# EAGLE design MSSRP-Temperature_System_beta_lite_2layer (EAGLE 6.5.0)
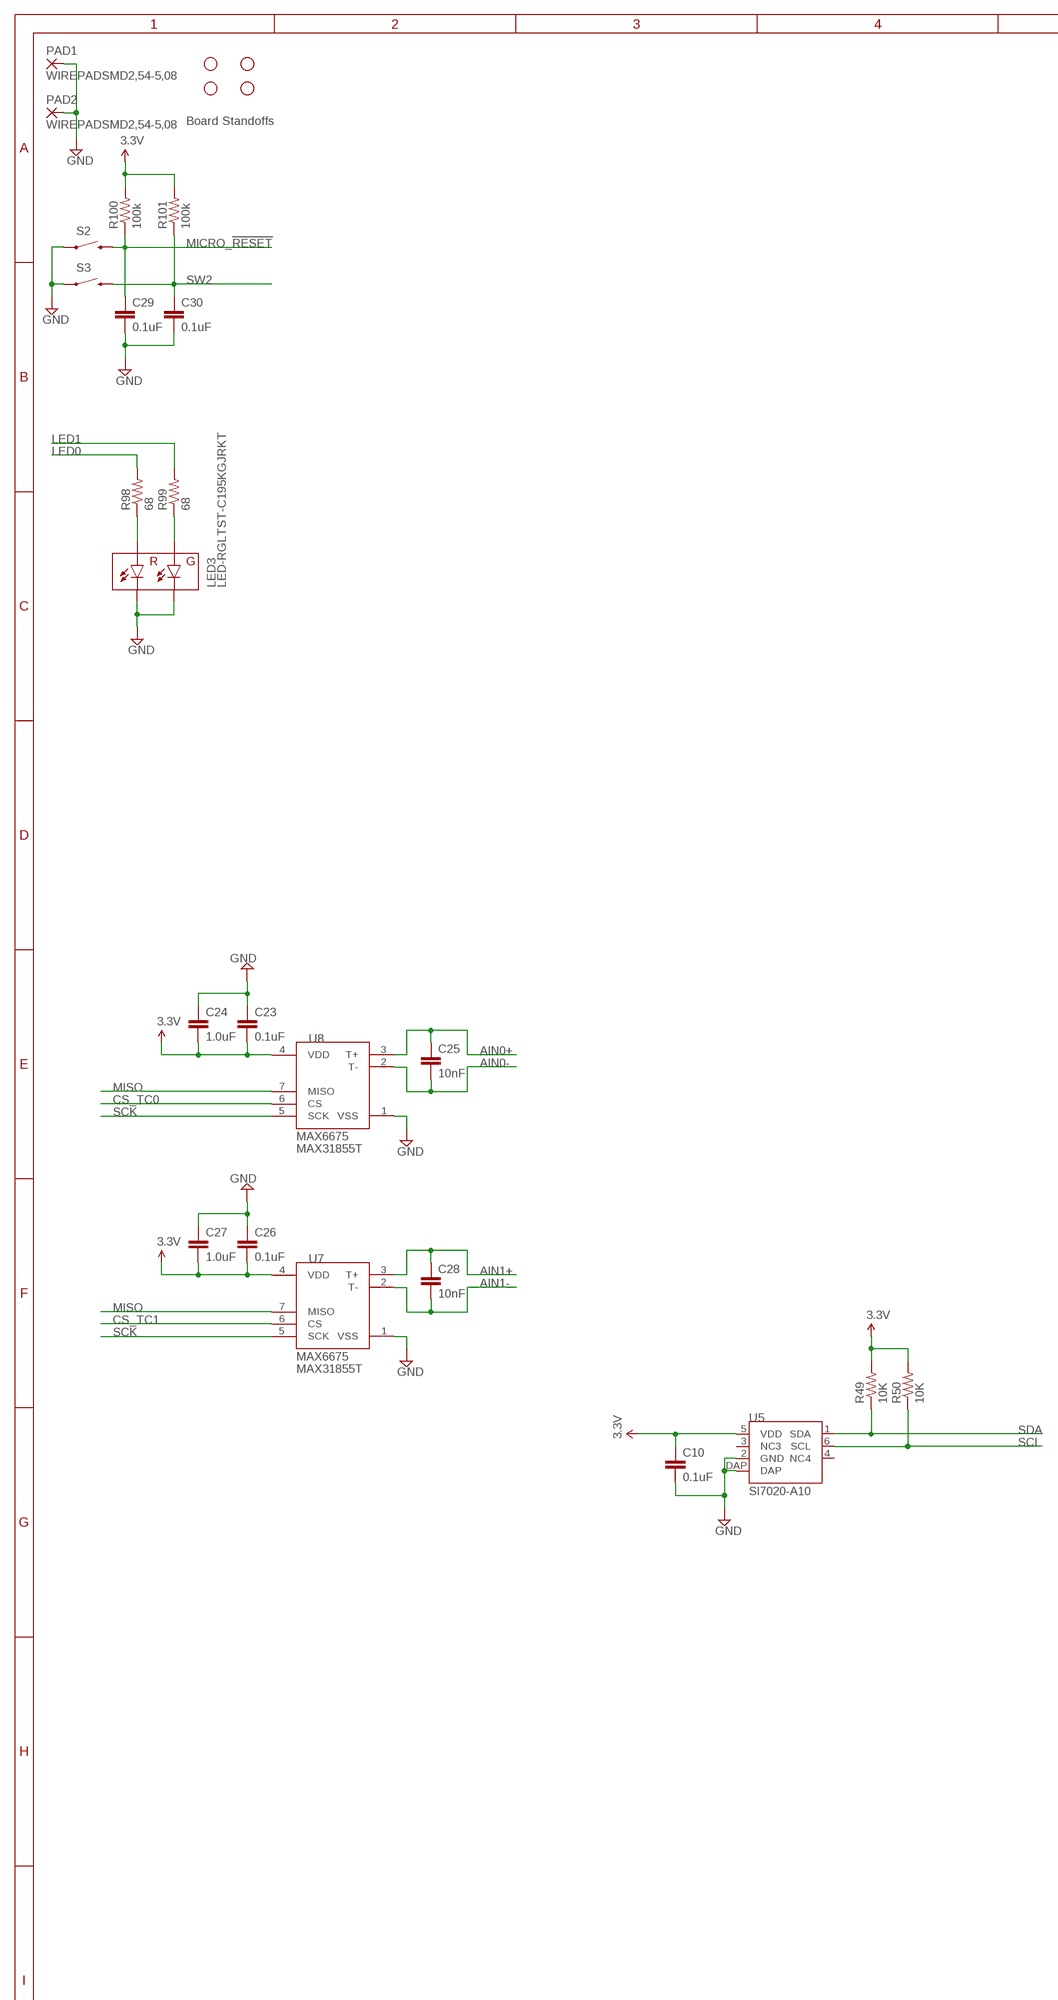
[diagram p0: schematic, sheet 1, part 1 of 2]
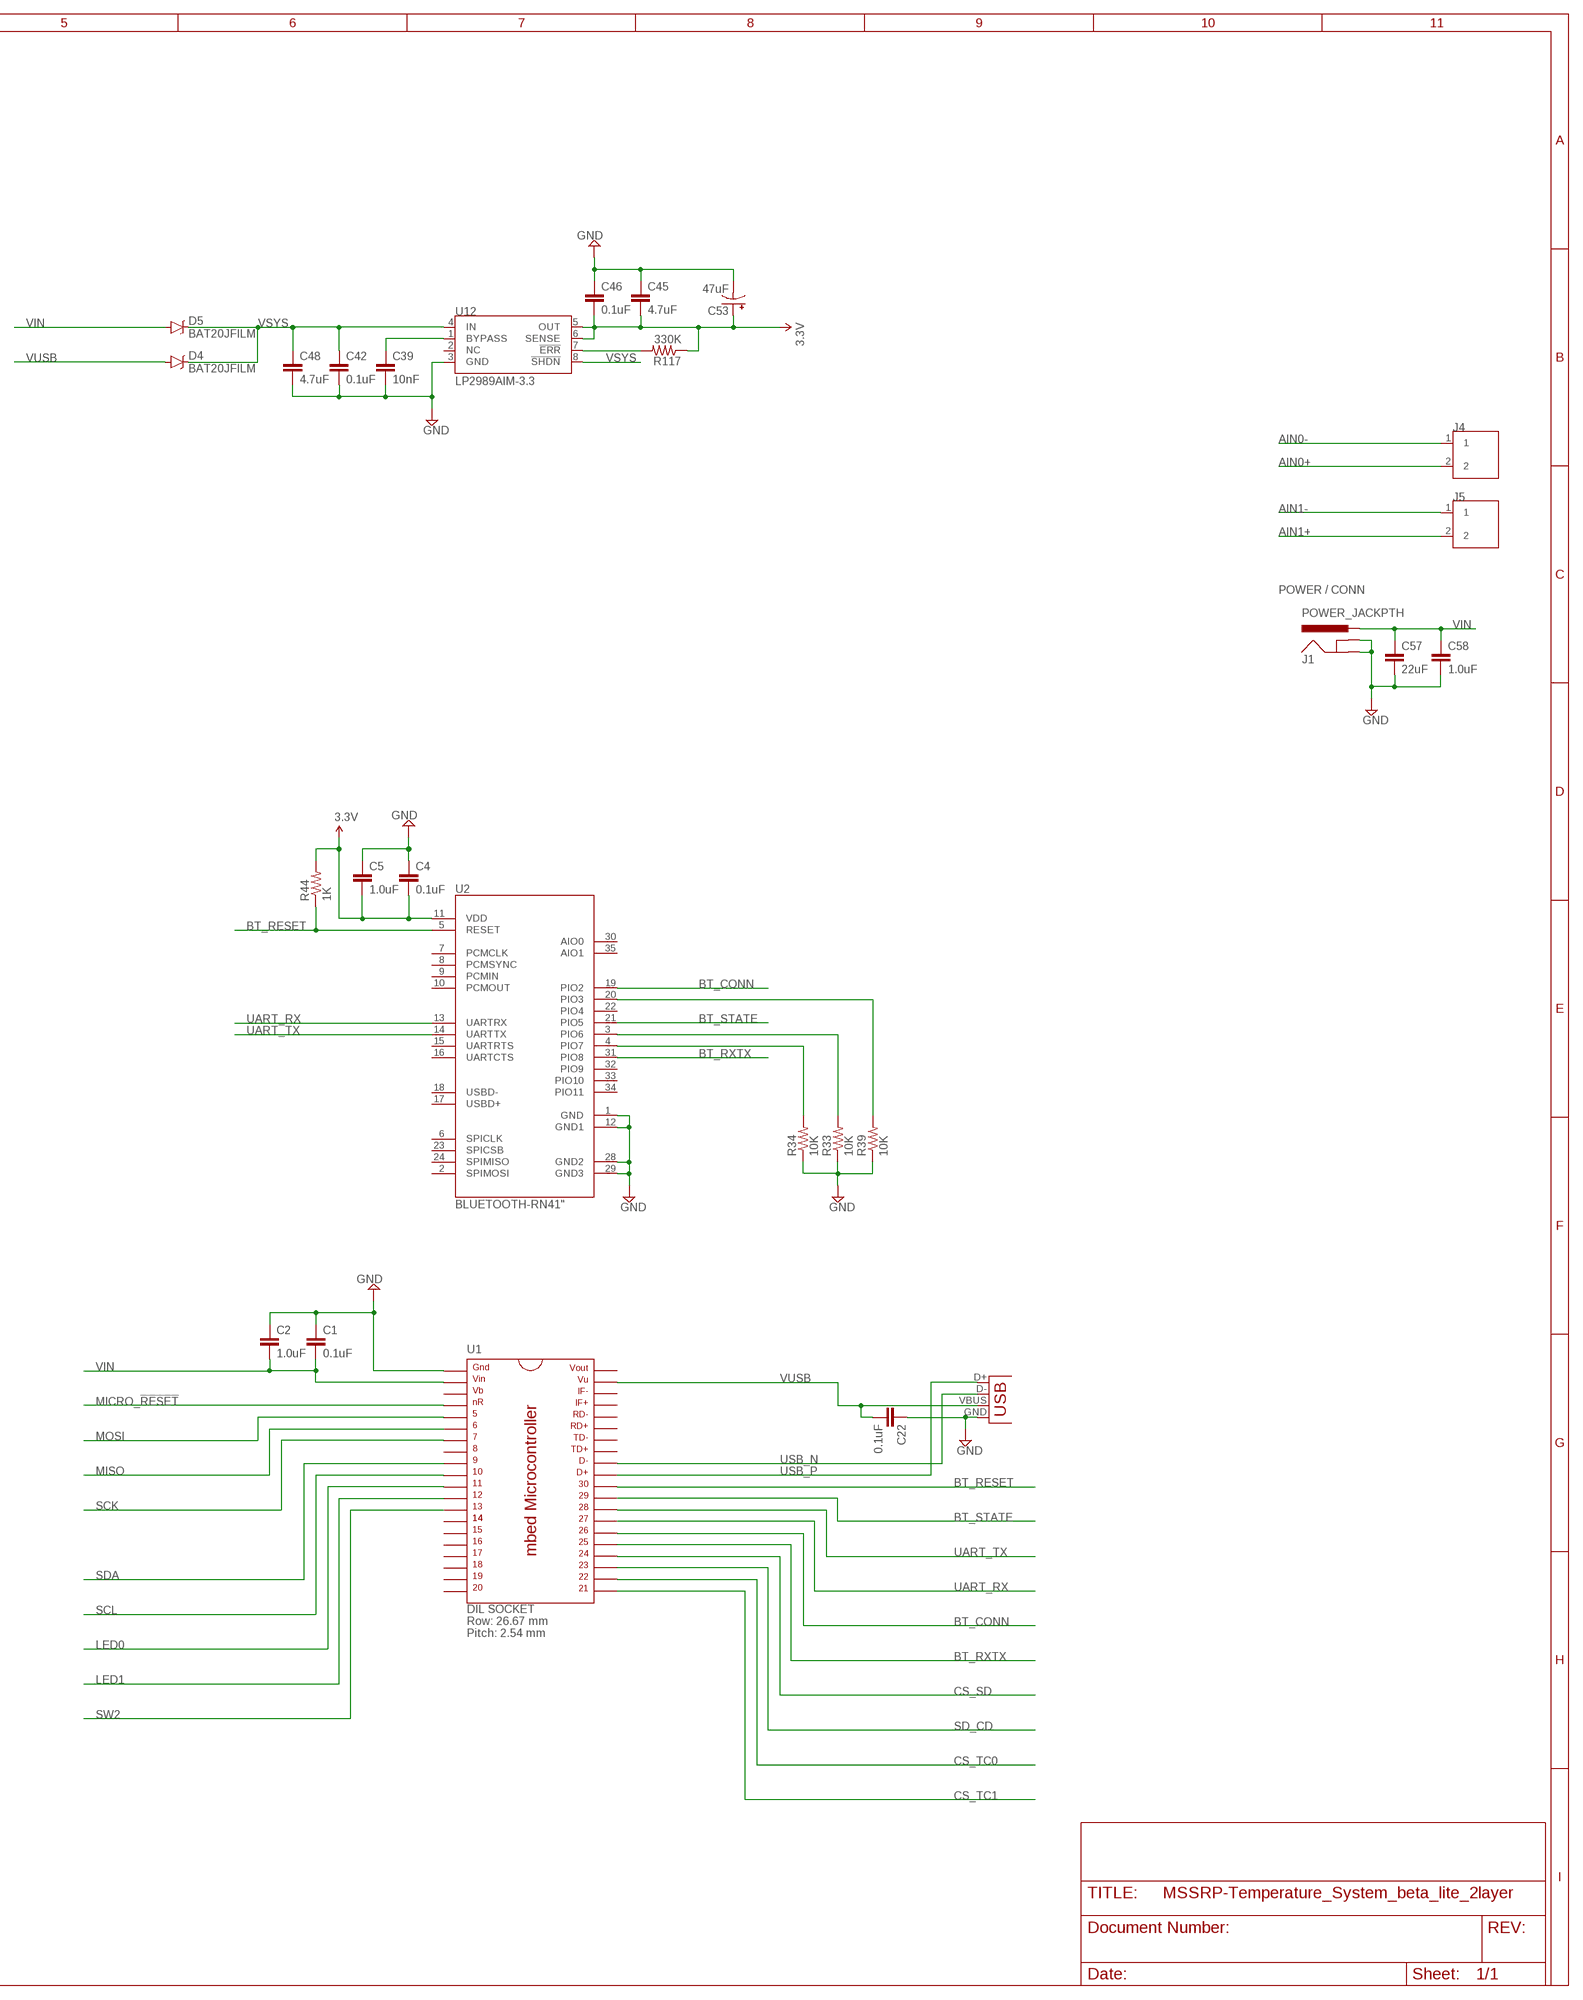
[diagram p1: schematic, sheet 1, part 2 of 2]

## Parts
C1  0.1uF  0.1UF-25V-5%(0603)  [0603-CAP]
C2  1.0uF  1.0UF-16V-10%(0603)  [0603-CAP]
C4  0.1uF  0.1UF-25V-5%(0603)  [0603-CAP]
C5  1.0uF  1.0UF-16V-10%(0603)  [0603-CAP]
C10  0.1uF  0.1UF-25V-5%(0603)  [0603-CAP]
C22  0.1uF  0.1UF-25V-5%(0603)  [0603-CAP]
C23  0.1uF  0.1UF-25V-5%(0603)  [0603-CAP]
C24  1.0uF  1.0UF-16V-10%(0603)  [0603-CAP]
C25  10nF  10NF/10000PF-50V-10%(0603)  [0603-CAP]
C26  0.1uF  0.1UF-25V-5%(0603)  [0603-CAP]
C27  1.0uF  1.0UF-16V-10%(0603)  [0603-CAP]
C28  10nF  10NF/10000PF-50V-10%(0603)  [0603-CAP]
C29  0.1uF  0.1UF-25V-5%(0603)  [0603-CAP]
C30  0.1uF  0.1UF-25V-5%(0603)  [0603-CAP]
C39  10nF  10NF/10000PF-50V-10%(0603)  [0603-CAP]
C42  0.1uF  0.1UF-25V-5%(0603)  [0603-CAP]
C45  4.7uF  4.7UF-6.3V-10%(0603)0603  [0603-CAP]
C46  0.1uF  0.1UF-25V-5%(0603)  [0603-CAP]
C48  4.7uF  4.7UF-6.3V-10%(0603)0603  [0603-CAP]
C53  47uF  47UF-10V-10%(TANT)  [EIA3528]
C57  22uF  22UF-16V-20%-(1210)  [1210]
C58  1.0uF  1.0UF-16V-10%(0603)  [0603-CAP]
D4  BAT20JFILM  [SOD-323]
D5  BAT20JFILM  [SOD-323]
J1  POWER_JACKPTH  [POWER_JACK_PTH]
J4  TE-2-TERMBLOCK  [TE-2-TERMBLOCK]
J5  TE-2-TERMBLOCK  [TE-2-TERMBLOCK]
JP1  USB-A-SMD  [USB-A-S-NOSILK-FEMALE]
LED3  LED-RGLTST-C195KGJRKT  [LTST-C195KGJRKT]
PAD1  WIREPADSMD2,54-5,08  [SMD2,54-5,08]
PAD2  WIREPADSMD2,54-5,08  [SMD2,54-5,08]
R33  10K  10KOHM1/10W1%(0603)0603  [0603-RES]
R34  10K  10KOHM1/10W1%(0603)0603  [0603-RES]
R39  10K  10KOHM1/10W1%(0603)0603  [0603-RES]
R44  1K  1KOHM1/10W1%(0603)  [0603-RES]
R49  10K  10KOHM1/10W1%(0603)0603  [0603-RES]
R50  10K  10KOHM1/10W1%(0603)0603  [0603-RES]
R98  68  470OHM1/10W1%(0603)  [0603-RES]
R99  68  470OHM1/10W1%(0603)  [0603-RES]
R100  100k  100KOHM1/10W1%(0603)  [0603-RES]
R101  100k  100KOHM1/10W1%(0603)  [0603-RES]
R117  330K  330KOHM1/10W1%(0603)0603  [0603-RES]
S2  SWITCH-MOMENTARY-2-SMD-1101NE  [TACTILE-SWITCH-1101NE]
S3  SWITCH-MOMENTARY-2-SMD-1101NE  [TACTILE-SWITCH-1101NE]
STANDOFF1  STAND-OFF  [STAND-OFF]
STANDOFF2  STAND-OFF  [STAND-OFF]
STANDOFF3  STAND-OFF  [STAND-OFF]
STANDOFF4  STAND-OFF  [STAND-OFF]
U1  MBED  [DIL40_0.9]
U2  BLUETOOTH-RN41"  [RN41]
U5  SI7020-A10  [DFN6]
U7  MAX6675  [SO08-MAX6675]
U8  MAX6675  [SO08-MAX6675]
U12  LP2989AIM  [SOIC8]

## Nets
3.3V: C4.2 C5.2 C10.1 C23.2 C24.2 C26.2 C27.2 C45.2 C46.2 C53.A(+) R44.2 R49.2 R50.2 R100.2 R101.2 R117.1 U2.11(VDD) U5.5(VDD) U7.4(VDD) U8.4(VDD) U12.5(OUT) U12.6(SENSE)
AIN0+: C25.1 J4.2 U8.3(T+)
AIN0-: C25.2 J4.1 U8.2(T-)
AIN1+: C28.1 J5.2 U7.3(T+)
AIN1-: C28.2 J5.1 U7.2(T-)
BT_CONN: U1.26 U2.19(PIO2)
BT_RESET: R44.1 U1.30 U2.5(RESET)
BT_RXTX: U1.25 U2.31(PIO8)
BT_STATE: U1.29 U2.21(PIO5)
CS_SD: U1.24
CS_TC0: U1.22 U8.6(CS)
CS_TC1: U1.21 U7.6(CS)
GND: C1.1 C2.1 C4.1 C5.1 C10.2 C22.1 C23.1 C24.1 C26.1 C27.1 C29.2 C30.2 C39.2 C42.2 C45.1 C46.1 C48.2 C53.C(-) C57.2 C58.2 J1.GND J1.GNDBREAK JP1.GND LED3.P$3(GC) LED3.P$4(RC) PAD1.1(P) PAD2.1(P) R33.1 R34.1 R39.1 S2.P$1 S3.P$1 U1.1 U2.1(GND) U2.12(GND1) U2.28(GND2) U2.29(GND3) U5.2(GND) U5.DAP U7.1(VSS) U8.1(VSS) U12.3(GND)
LED0: R98.2 U1.11
LED1: R99.2 U1.12
MICRO_!RESET: C29.1 R100.1 S2.P$2 U1.4
MISO: U1.6 U7.7(MISO) U8.7(MISO)
MOSI: U1.5
N$33: R34.2 U2.4(PIO7)
N$34: R33.2 U2.3(PIO6)
N$39: R39.2 U2.20(PIO3)
N$92: LED3.P$2(RA) R98.1
N$93: LED3.P$1(GA) R99.1
N$116: C39.1 U12.1(BYPASS)
N$118: R117.2 U12.7(!ERR)
SCK: U1.7 U7.5(SCK) U8.5(SCK)
SCL: R50.1 U1.10 U5.6(SCL)
SD_CD: U1.23
SDA: R49.1 U1.9 U5.1(SDA)
SW2: C30.1 R101.1 S3.P$2 U1.13
UART_RX: U1.27 U2.13(UARTRX)
UART_TX: U1.28 U2.14(UARTTX)
USB_N: JP1.D- U1.32
USB_P: JP1.D+ U1.31
VIN: C1.2 C2.2 C57.1 C58.1 D5.A J1.PWR U1.2
VSYS: C42.1 C48.1 D4.C D5.C U12.4(IN) U12.8(!SHDN)
VUSB: C22.2 D4.A JP1.VBUS U1.39
Unconnected: U1.3 U1.8 U1.14 U1.15 U1.16 U1.17 U1.18 U1.19 U1.20 U1.33 U1.34 U1.35 U1.36 U1.37 U1.38 U1.40 U2.2(SPIMOSI) U2.6(SPICLK) U2.7(PCMCLK) U2.8(PCMSYNC) U2.9(PCMIN) U2.10(PCMOUT) U2.15(UARTRTS) U2.16(UARTCTS) U2.17(USBD+) U2.18(USBD-) U2.22(PIO4) U2.23(SPICSB) U2.24(SPIMISO) U2.30(AIO0) U2.32(PIO9) U2.33(PIO10) U2.34(PIO11) U2.35(AIO1) U5.3(NC3) U5.4(NC4) U12.2(NC)

## Notes on the sheet
- Board Standoffs
- LP2989AIM-3.3
- POWER / CONN
- MAX31855T
- MAX31855T
- DIL SOCKET
  Row: 26.67 mm
  Pitch: 2.54 mm

## Library data of the parts
C1 C4 C10 C22 C23 C26 C29 C30 C42 C46 = SparkFun-Capacitors:0.1UF-25V-5%(0603): CAP-08604; PROD_ID: CAP-08604
C2 C5 C24 C27 C58 = SparkFun-Capacitors:1.0UF-16V-10%(0603): CAP-00868; PROD_ID: CAP-00868
C25 C28 C39 = SparkFun-Capacitors:10NF/10000PF-50V-10%(0603): CAP-00867; PROD_ID: CAP-00867
C45 C48 = SparkFun-Capacitors:4.7UF-6.3V-10%(0603): CAP-08280; PROD_ID: CAP-08280
C53 = SparkFun-Capacitors:47UF-10V-10%(TANT): CAP-08310 47uF Tantalum SMT 10V 10% (EIA-3528); PROD_ID: CAP-08310
C57 = SparkFun-Capacitors:22UF-16V-20%-(1210): CAP-10381; PROD_ID: CAP-10381
D4 D5 = SparkFun-DiscreteSemi:BAT20JFILM: 23V, 1A Schottky diode, SOD-323 package; PROD_ID: DIO-11623
J1 = SparkFun-Connectors:POWER_JACK: Power Jack This is the standard 5.5mm barrel jack for power. The PTH is the most common, proven, reliable, footprint. The Slot footprint only works if the mill layer is transmitted to the PCB fab house so be warned. Mating wall wart : TOL-00298 (and others); PROD_ID: PRT-00119
J4 J5 = MSSRP-Lib:TE-2-TERMBLOCK
JP1 = SparkFun-Connectors:USB: USB Connectors USB-B-PTH is fully proven SKU : PRT-00139/CONN-08278 USB-miniB is fully proven SKU : PRT-00587 USB-A-PCB is untested. USB-A-H is throughly reviewed, but untested. Spark Fun Electronics SKU : PRT-00437 USB-B-SMT is throughly reviewed, but untested. Needs silkscreen touching up. USB-A-S has not been used/tested USB-MB-H has not been used/tested USB-MICROB has been used. CONN-09505; PROD_ID: CONN-09520
LED3 = SparkFun-LED:LED-RG; PROD_ID: DIO-12140
PAD1 PAD2 = wirepad:WIREPAD: Wire PAD connect wire on PCB
R33 R34 R39 R49 R50 = SparkFun-Resistors:10KOHM1/10W1%(0603): RES-00824; PROD_ID: RES-00824
R44 = SparkFun-Resistors:1KOHM1/10W1%(0603): RES-07856; PROD_ID: RES-07856
R98 R99 = SparkFun-Resistors:470OHM1/10W1%(0603): RES-07869; PROD_ID: RES-07869; VALUE: 470
R100 R101 = SparkFun-Resistors:100KOHM1/10W1%(0603): RES-07828; PROD_ID: RES-07828
R117 = SparkFun-Resistors:330KOHM1/10W1%(0603): RES-08968; PROD_ID: RES-08968
S2 S3 = SparkFun-Electromechanical:SWITCH-MOMENTARY-2: Various NO switches- pushbuttons, reed, etc
STANDOFF1-STANDOFF4 = SparkFun-Electromechanical:STAND-OFF: #4 Stand Off This is the mechanical footprint for a #4 phillips button head screw. Use the keepout ring to avoid running the screw head into surrounding components. SKU : PRT-00447
U1 = microbuilder:MBED: mbed Microcontroller, DIP40, 0.9"
U2 = SparkFun-RF:BLUETOOTH-RN41: Bluetooth SMD module
U5 = MSSRP-Lib:SI7020
U7 U8 = SparkFun-AnalogIC:MAX6675: K-type thermocouple ADC, SPI output
U12 = MSSRP-Lib:LP2989

## Net classes
0 default: width 0.203 mm, clearance 0.203 mm

## Board
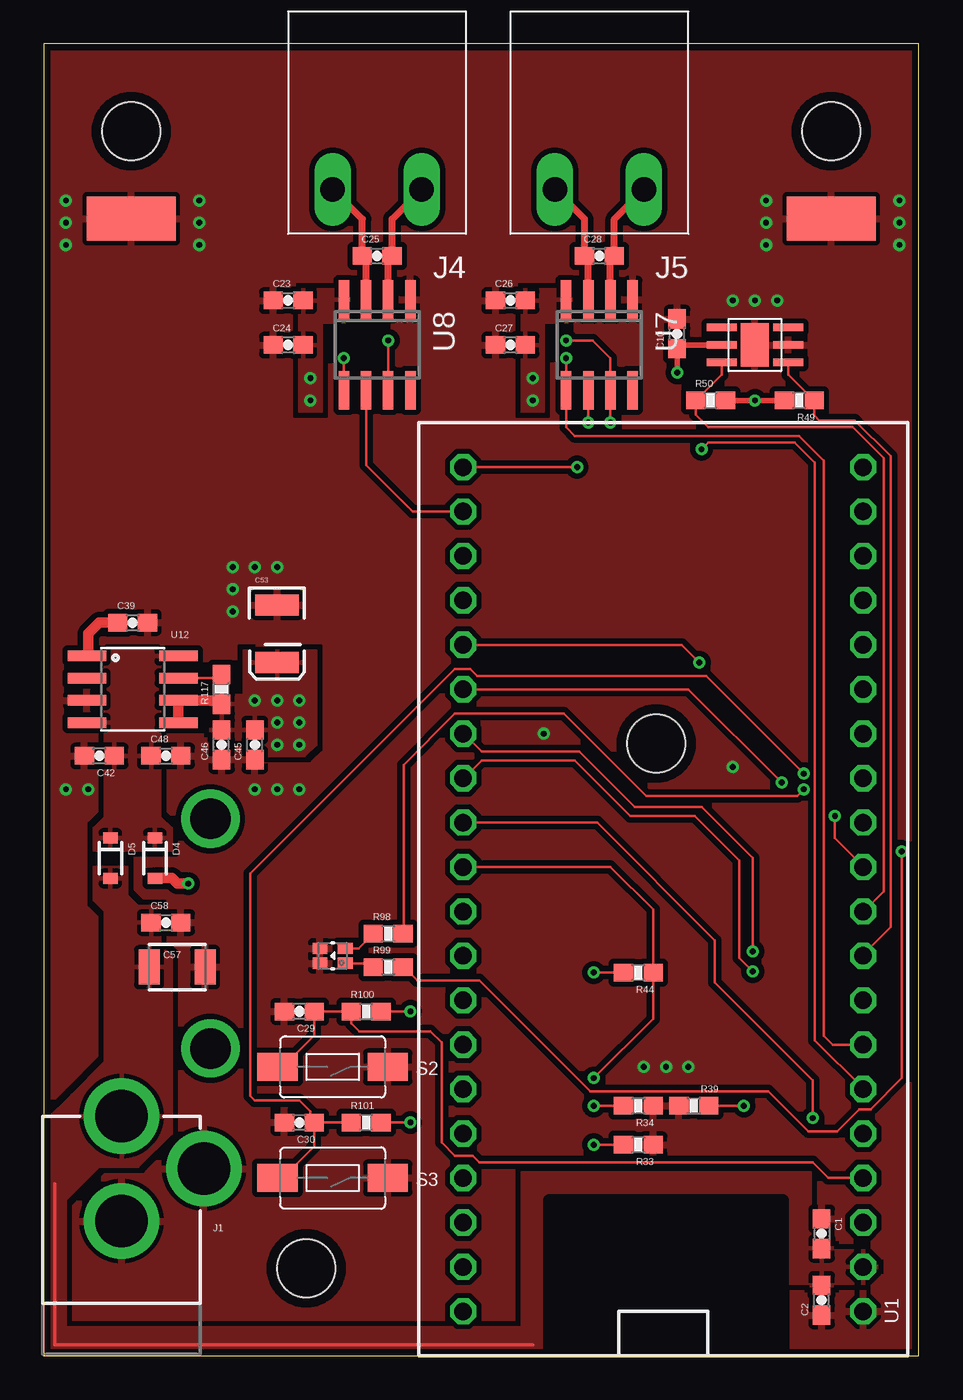
[diagram p2: board, top side]
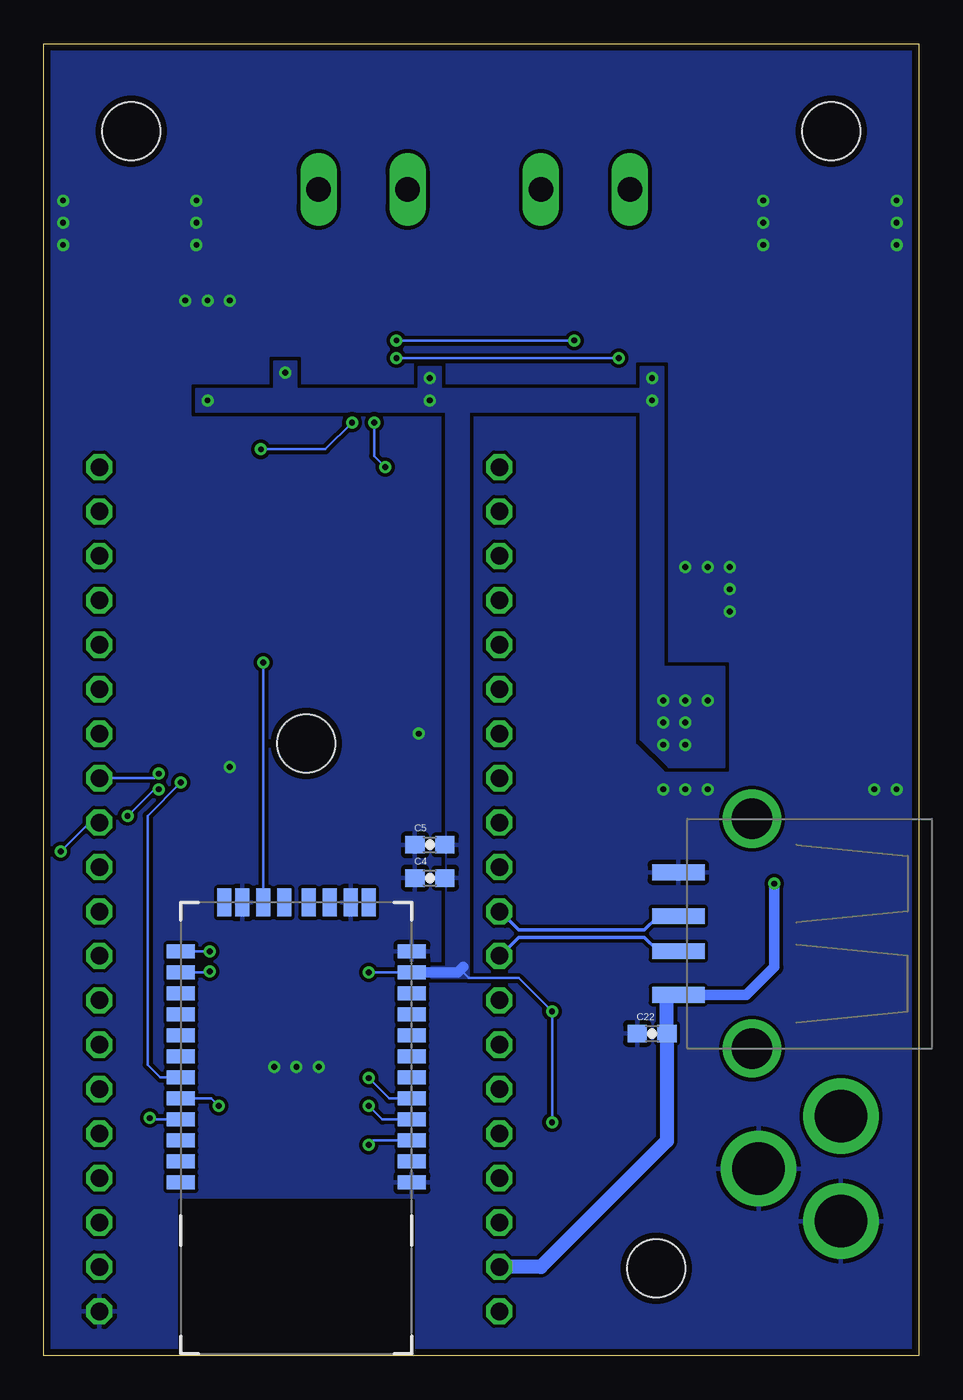
[diagram p3: board, bottom side, seen from below]

Size 50 x 75 mm. Coordinates in mm from the lower left corner, seen from the top.
Outline: 0,0 50,0 50,75 0,75 0,0
Copper layers (1*16): Top 0.0356mm / dielectric 1.5011mm / Bottom 0.0356mm
Design rules "LaenPCBOrder": minimum track width 6mil, minimum drill 13mil, track to track 6mil, track to pad 6mil, pad to pad 6mil, via to via 6mil, smd to smd 6mil, copper to edge 15mil, drill to drill 6mil, minimum pad ring 7mil, minimum via ring 7mil, stop-mask expansion 3mil, vias tented up to drill 0mil, thermal gap 10mil
tRestrict: area 28.9,0 to 42.2,8.9
bRestrict: area 28.9,0 to 42.2,8.9

### Footprints (pad centres in the part's own frame; a part is rotated, then mirrored left to right if it is on the bottom)
0603-CAP = smd 1.1 x 1: 1 -0.85,0; 2 0.85,0
EIA3528 = smd 1.2 x 2.5: A 1.65,0; C -1.65,0
1210 = smd 1.2 x 2: 1 -1.6,0; 2 1.6,0
SOD-323 = smd 0.63 x 0.83: A 1.15,0; C -1.15,0
POWER_JACK_PTH = drill 2.997 pad 4.318: GND 0,7.7; GNDBREAK 4.7,10.7; PWR 0,13.7
TE-2-TERMBLOCK = drill 1.4 long: 1 -2.54,0; 2 2.54,0
USB-A-S-NOSILK-FEMALE = smd 3 x 0.9: D+ 4.212,-1; D- 4.212,1; GND 4.212,-3.5; VBUS 4.212,3.5 | drill 2.311: S1 0,-6.566; S2 0,6.566
LTST-C195KGJRKT = smd 0.65 x 0.85: P$1 0.425,0.725; P$2 -0.425,0.725; P$3 0.425,-0.725; P$4 -0.425,-0.725
SMD2,54-5,08 = smd 2.54 x 5.08: 1 0,0
0603-RES = smd 1.1 x 1: 1 -0.85,0; 2 0.85,0
TACTILE-SWITCH-1101NE = smd 2.3 x 1.6: P$1 -3.15,0; P$2 3.15,0
STAND-OFF = hole 3.302: 0,0
DIL40_0.9 = drill 1 pad 1.397 octagon: 1 -22.86,-11.43; 2 -20.32,-11.43; 3 -17.78,-11.43; 4 -15.24,-11.43; 5 -12.7,-11.43; 6 -10.16,-11.43; 7 -7.62,-11.43; 8 -5.08,-11.43; 9 -2.54,-11.43; 10 0,-11.43; 11 2.54,-11.43; 12 5.08,-11.43; 13 7.62,-11.43; 14 10.16,-11.43; 15 12.7,-11.43; 16 15.24,-11.43; 17 17.78,-11.43; 18 20.32,-11.43; 19 22.86,-11.43; 20 25.4,-11.43; 21 25.4,11.43; 22 22.86,11.43; 23 20.32,11.43; 24 17.78,11.43; 25 15.24,11.43; 26 12.7,11.43; 27 10.16,11.43; 28 7.62,11.43; 29 5.08,11.43; 30 2.54,11.43; 31 0,11.43; 32 -2.54,11.43; 33 -5.08,11.43; 34 -7.62,11.43; 35 -10.16,11.43; 36 -12.7,11.43; 37 -15.24,11.43; 38 -17.78,11.43; 39 -20.32,11.43; 40 -22.86,11.43
RN41 = smd 0.8 x 1.6: 1 -6.6,-6.6; 2 -5.4,-6.6; 3 -4.2,-6.6; 4 -3,-6.6; 5 -1.8,-6.6; 6 -0.6,-6.6; 7 0.6,-6.6; 8 1.8,-6.6; 9 3,-6.6; 10 4.2,-6.6; 11 5.4,-6.6; 12 6.6,-6.6; 13 6.6,6.6; 14 5.4,6.6; 15 4.2,6.6; 16 3,6.6; 17 1.8,6.6; 18 0.6,6.6; 19 -0.6,6.6; 20 -1.8,6.6; 21 -3,6.6; 22 -4.2,6.6; 23 -5.4,6.6; 24 -6.6,6.6 | smd 1.6 x 0.8: 28 9.4,3.1; 29 9.4,-3.1; 30 9.4,4.122; 31 9.4,1.9; 32 9.4,0.7; 33 9.4,-0.7; 34 9.4,-1.9; 35 9.4,-4.122
DFN6 = smd 1.7 x 0.45: 1 -1.9,1; 2 -1.9,0; 3 -1.9,-1; 4 1.9,-1; 5 1.9,0; 6 1.9,1 | smd 1.6 x 2.5: DAP 0,0
SO08-MAX6675 = smd 0.6 x 2.2: 1 -1.905,-2.6; 2 -0.635,-2.6; 3 0.635,-2.6; 4 1.905,-2.6; 5 1.905,2.6; 6 0.635,2.6; 7 -0.635,2.6; 8 -1.905,2.6
SOIC8 = smd 0.61 x 2.21: 1 -1.905,-2.616; 2 -0.635,-2.616; 3 0.635,-2.616; 4 1.905,-2.616; 5 1.905,2.616; 6 0.635,2.616; 7 -0.635,2.616; 8 -1.905,2.616

### Placement (x,y rotation side)
C1  44.45,6.99 270 top
C2  44.45,3.17 90 top
C4  27.94,27.3 0 bottom
C5  27.94,29.21 0 bottom
C10  36.2,58.42 90 top
C22  15.24,18.41 0 bottom
C23  13.97,60.33 0 top
C24  13.97,57.78 0 top
C25  19.05,62.87 0 top
C26  26.67,60.33 0 top
C27  26.67,57.78 0 top
C28  31.75,62.87 0 top
C29  14.61,19.68 180 top
C30  14.61,13.34 180 top
C39  5.08,41.91 0 top
C42  3.17,34.29 180 top
C45  12.06,34.92 90 top
C46  10.16,34.92 90 top
C48  6.99,34.29 0 top
C53  13.34,41.27 270 top
C57  7.62,22.23 0 top
C58  6.99,24.77 0 top
D4  6.35,28.45 270 top
D5  3.81,28.45 270 top
J1  4.45,0 0 top
J4  19.05,66.67 180 top
J5  31.75,66.67 180 top
JP1  9.53,24.13 180 bottom
LED3  16.51,22.86 270 top
PAD1  5,65 90 top
PAD2  45,65 270 top
R33  33.97,12.06 180 top
R34  33.97,14.29 180 top
R39  37.15,14.29 0 top
R44  33.97,21.91 180 top
R49  43.18,54.61 180 top
R50  38.1,54.61 0 top
R98  19.68,24.13 0 top
R99  19.68,22.23 0 top
R100  18.41,19.68 0 top
R101  18.41,13.34 0 top
R117  10.16,38.1 90 top
S2  16.51,16.51 180 top
S3  16.51,10.16 180 top
STANDOFF1  5,70 0 top
STANDOFF2  35,35 0 top
STANDOFF3  15,5 0 top
STANDOFF4  45,70 0 top
U1  35.4,25.4 90 top
U2  35.56,16.51 90 bottom
U5  40.64,57.78 180 top
U7  31.75,57.78 180 top
U8  19.05,57.78 180 top
U12  5.08,38.1 270 top

### Tracks (layer width: path | path; a pad name or v marks a point on that pad's centre or on a via)
3.3V  (via drill 0.33)
  Top 0.152: v31.43,21.91 R44.2 | v20.95,19.68 R100.2 | R101.2 v20.95,13.34
  Top 0.305: U5.5 36.41,57.78 C10.1 v36.2,56.2 | R50.2 v40.64,54.61 R49.2
  Top 0.61: U12.5 U12.6 9.95,37.47 R117.1
  Bottom 0.152: U2.11 v31.43,21.91 | 26.04,22.23 26.04,21.91 25.72,21.59 22.86,21.59 v20.95,19.68 v20.95,13.34
  Bottom 0.61: U2.11 26.35,21.91 26.04,22.23
  other vias: 15.24,55.88 15.24,54.61 27.94,54.61 12.06,37.47 13.34,37.47 14.61,37.47 14.61,36.2 13.34,36.2 13.34,34.92 14.61,34.92 27.94,55.88
  pour Bottom (isolate 0.254): 14.61,53.98 15.88,53.98 15.88,56.52 14.61,56.52
  pour Bottom (isolate 0.254): 15.88,55.24 28.57,55.24 28.57,53.98 15.88,53.98
  pour Bottom (isolate 0.254): 28.57,56.52 28.57,53.98 27.3,53.98 27.3,56.52
  pour Bottom (isolate 0.254): 28.57,55.24 41.27,55.24 41.27,53.98 28.57,53.98
  pour Bottom (isolate 0.254): 14.61,55.24 15.88,55.24 15.88,45.4 15.88,35.24 14.29,33.66 11.11,33.66 11.11,39.37 13.65,39.37 14.29,39.37 14.61,39.37
  pour Top (isolate 0.254): 9.53,37.78 9.53,35.24 12.7,35.24 12.7,34.61 12.7,34.29 14.92,34.29 15.56,34.92 15.56,40.32 11.75,40.32 11.43,40.32 11.43,37.78
  pour Bottom (isolate 0.254): 35.56,55.24 35.56,56.83 36.83,56.83 36.83,55.24
  pour Top (isolate 0.254): 14.61,53.98 15.88,53.98 15.88,59.05 17.46,59.05 17.46,60.96 14.61,60.96
  pour Top (isolate 0.254): 27.3,53.98 28.57,53.98 28.57,59.05 30.16,59.05 30.16,60.96 27.3,60.96
  pour Bottom (isolate 0.254): 26.99,55.24 25.72,55.24 25.72,21.59 26.99,21.59
  pour Bottom (isolate 0.254): 25.72,21.59 29.53,21.59 29.53,22.23 25.72,22.23
AIN0+
  Top 0.406: J4.2 18.2,64.98 C25.1 18.41,62.65 U8.3
AIN0-
  Top 0.406: J4.1 19.9,64.98 C25.2 19.68,62.65 U8.2
AIN1+
  Top 0.406: J5.2 30.9,64.98 C28.1 31.11,62.65 U7.3
AIN1-
  Top 0.406: J5.1 32.6,64.98 C28.2 32.38,62.65 U7.2
BT_CONN  (via drill 0.33)
  Top 0.152: U1.26 36.83,38.1 v42.16,32.77
  Bottom 0.152: v42.16,32.77 44.07,30.86 44.07,16.64 43.34,15.91 U2.19
BT_RESET  (via drill 0.33)
  Top 0.152: v31.43,15.88 34.82,19.27 R44.1 34.82,25.5 32.38,27.94 U1.30
  Bottom 0.152: U2.5 30.27,14.71 v31.43,15.88
BT_RXTX  (via drill 0.33)
  Top 0.152: U1.25 36.45,40.64 v37.47,39.62
  Bottom 0.152: v37.47,39.62 U2.31
BT_STATE  (via drill 0.33)
  Top 0.152: U1.29 31.62,30.48 38.35,23.75 38.35,21.34 43.94,15.75 v43.94,13.59
  Bottom 0.152: U2.21 43.86,13.51 v43.94,13.59
CS_TC0
  Top 0.152: U8.6 18.41,50.93 21.08,48.26 U1.22
CS_TC1  (via drill 0.33)
  Top 0.152: U7.6 v31.11,53.34 | v30.48,50.8 U1.21
  Bottom 0.152: v31.11,53.34 31.11,51.44 v30.48,50.8
GND  (via drill 0.33)
  other vias: 1.27,66.04 1.27,64.77 1.27,63.5 48.9,66.04 48.9,64.77 48.9,63.5 8.89,66.04 8.89,64.77 8.89,63.5 41.27,66.04 41.27,64.77 41.27,63.5 39.37,60.33 40.64,60.33 41.91,60.33 12.06,32.38 13.34,32.38 14.61,32.38 10.79,42.55 10.79,43.81 10.79,45.09 12.06,45.09 13.34,45.09 35.56,16.51 34.29,16.51 36.83,16.51 28.57,35.56 39.37,33.66 1.27,32.38 2.54,32.38
  pour Top (isolate 0.305, rank 6): -2.54,77.47 53.34,77.47 53.34,-3.81 -2.54,-3.81
  pour Bottom (rank 6): -0.64,75.56 50.8,75.56 50.8,-0.64 -0.64,-0.64
LED0  (via drill 0.33)
  Top 0.152: 20.57,24.13 20.57,33.78 23.5,36.7 29.72,36.7 34.42,32 43.05,32 v43.43,32.38 | U1.11 46.83,27.98 45.21,29.59 v45.21,30.86
  Top 0.203: 20.57,24.13 R98.2
  Bottom 0.152: v43.43,32.38 43.69,32.38 v45.21,30.86
LED1  (via drill 0.33)
  Top 0.152: 20.57,22.23 21.34,21.46 24.89,21.46 31.24,15.11 41.4,15.11 43.69,12.83 45.34,12.83 46.61,14.1 47.24,14.1 49.02,15.88 v49.02,28.83
  Top 0.203: 20.57,22.23 R99.2
  Bottom 0.152: v49.02,28.83 47.37,30.48 U1.12
MICRO_!RESET
  Top 0.152: S2.P$2 13.68,16.83 13.97,16.83 15.46,18.31 C29.1 R100.1 17.57,19.01 18.03,18.54 22.1,18.54 22.73,17.91 22.73,12.19 23.5,11.43 24.51,11.43 24.89,11.05 43.94,11.05 44.83,10.16 U1.4
MISO  (via drill 0.33)
  Top 0.152: U1.6 46.83,15.28 44.07,18.03 44.07,51.05 42.93,52.2 37.97,52.2 v37.59,51.82 | v32.38,53.34 U7.7 32.38,57.02 31.37,58.04 v29.84,58.04 | v19.68,58.04 U8.7
  Bottom 0.152: v37.59,51.82 33.91,51.82 v32.38,53.34 | v29.84,58.04 v19.68,58.04
N$33  (via drill 0.33)
  Top 0.152: v31.43,14.29 R34.2
  Bottom 0.152: U2.4 30.66,13.51 v31.43,14.29
N$34  (via drill 0.33)
  Top 0.152: v31.43,12.06 R33.2
  Bottom 0.152: U2.3 31.19,12.31 v31.43,12.06
N$39  (via drill 0.33)
  Top 0.152: v40.01,14.29 R39.2
  Bottom 0.152: U2.20 40.43,14.71 v40.01,14.29
N$92
  Top 0.152: LED3.P$2 17.99,23.29 R98.1
N$93
  Top 0.152: LED3.P$1 18.62,22.43 R99.1
N$116
  Top 0.61: C39.1 3.17,41.91 2.54,41.27 2.54,40.08 U12.1
N$118
  Top 0.152: U12.7 9.95,38.73 R117.2
SCK  (via drill 0.33)
  Top 0.152: U1.7 45.09,17.78 44.58,18.29 44.58,51.18 43.18,52.58 30.35,52.58 29.84,53.09 U7.5 | U7.5 29.84,56.64 | U7.5 v29.84,57.02 | v17.14,57.02 U8.5
  Bottom 0.152: v29.84,57.02 v17.14,57.02
SCL
  Top 0.152: U1.10 46.86,25.4 48.01,26.54 48.01,51.31 46.23,53.09 37.97,53.09 37.25,53.81 R50.1 38.74,56.1 U5.6
SDA
  Top 0.152: U1.9 46.83,22.95 48.39,24.51 48.39,51.44 46.35,53.47 44.32,53.47 44.03,53.76 R49.1 42.54,56.1 U5.1
SW2  (via drill 0.33)
  Top 0.152: C30.1 15.46,11.96 14.29,10.79 13.99,10.79 S3.P$2 | C30.1 R101.1 | v43.43,33.27 37.85,38.86 24.77,38.86 24.38,39.24 23.5,39.24 11.81,27.56 11.81,14.86 12.06,14.61 14.61,14.61 15.24,13.97 15.24,13.55 C30.1
  Bottom 0.152: U1.13 43.69,33.02 v43.43,33.27
UART_RX  (via drill 0.33)
  Top 0.152: U1.27 24,35.56 25.02,34.54 30.61,34.54 33.78,31.37 37.59,31.37 40.52,28.44 v40.52,23.11
  Bottom 0.152: U2.13 v40.52,23.11 v40.51,23.11
UART_TX  (via drill 0.33)
  Top 0.152: U1.28 24,33.02 25.02,34.04 30.35,34.04 33.53,30.86 37.21,30.86 39.75,28.32 39.75,22.73 v40.51,21.97
  Bottom 0.152: U2.14 40.57,21.91 v40.51,21.97
USB_N
  Bottom 0.203: U1.32 23.93,22.86 22.86,23.93 15.67,23.93 14.92,23.18 13.78,23.18 JP1.D-
USB_P
  Bottom 0.203: U1.31 23.93,25.4 22.86,24.33 15.67,24.33 14.92,25.08 13.78,25.08 JP1.D+
VIN
  Top 0.203: 0.64,9.84 0.64,0.64 27.94,0.64
  pour Top (isolate 0.254): 4.45,10.79 5.4,10.79 7.3,12.7 7.3,22.86 6.67,23.5 6.67,25.72 5.4,25.72 4.76,26.35 4.76,27.94 2.86,27.94 2.86,26.35 2.86,26.04 3.49,25.4 3.49,16.83 1.59,14.92 1.59,12.38 3.17,10.79
  pour Top (isolate 0.254): 45.09,7.3 43.81,7.3 43.81,2.86 45.09,2.86 45.09,4.13 47.62,4.13 47.62,6.03 45.09,6.03
  pour Top (isolate 0.254): 43.81,4.13 42.55,4.13 42.55,9.21 28.57,9.21 28.57,0 27.3,0 27.3,10.48 43.81,10.48
  pour Top (isolate 0.254): 28.57,0 28.57,1.59 0,1.59 0,0
  pour Top (isolate 0.254): 0,1.59 1.27,1.59 1.27,8.89 3.17,10.79 1.59,14.92 0,13.34
VSYS
  pour Top (isolate 0.254): 3.49,40.32 6.67,40.32 6.67,30.8 7.3,30.16 7.3,28.89 2.86,28.89 2.86,30.16 3.49,30.8
VUSB  (via drill 0.33)
  Top 0.61: D4.A 7.3,27.3 7.62,26.99 v8.26,26.99
  Bottom 0.61: v8.26,26.99 8.26,22.23 9.85,20.63 JP1.VBUS 14.61,20.64 14.39,20.42
  Bottom 0.813: 14.39,20.42 C22.2 14.39,12.28 21.59,5.08 U1.39